# Altium schematic sheet [02] - BLOCK DIAGRAM.SchDoc
size A2; DocumentNumber: 2; SheetNumber: 2; SheetTotal: 6; PageSetup: Record=PageOptions|CenterHorizontal=True|CenterVertical=True|PrintScale=0.52|XCorrection=1.00|YCorrection=1.00|PrintKind=1|BorderSize=5000000|LeftOffset=0|BottomOffset=0|Orientation=2|PaperLength=1000|PaperWidth=1000|Scale=100|PaperSource=4|PrintQuality=600|MediaType=1|DitherType=10|PrintScaleMode=1|PaperKind=A4|PaperIndex=9
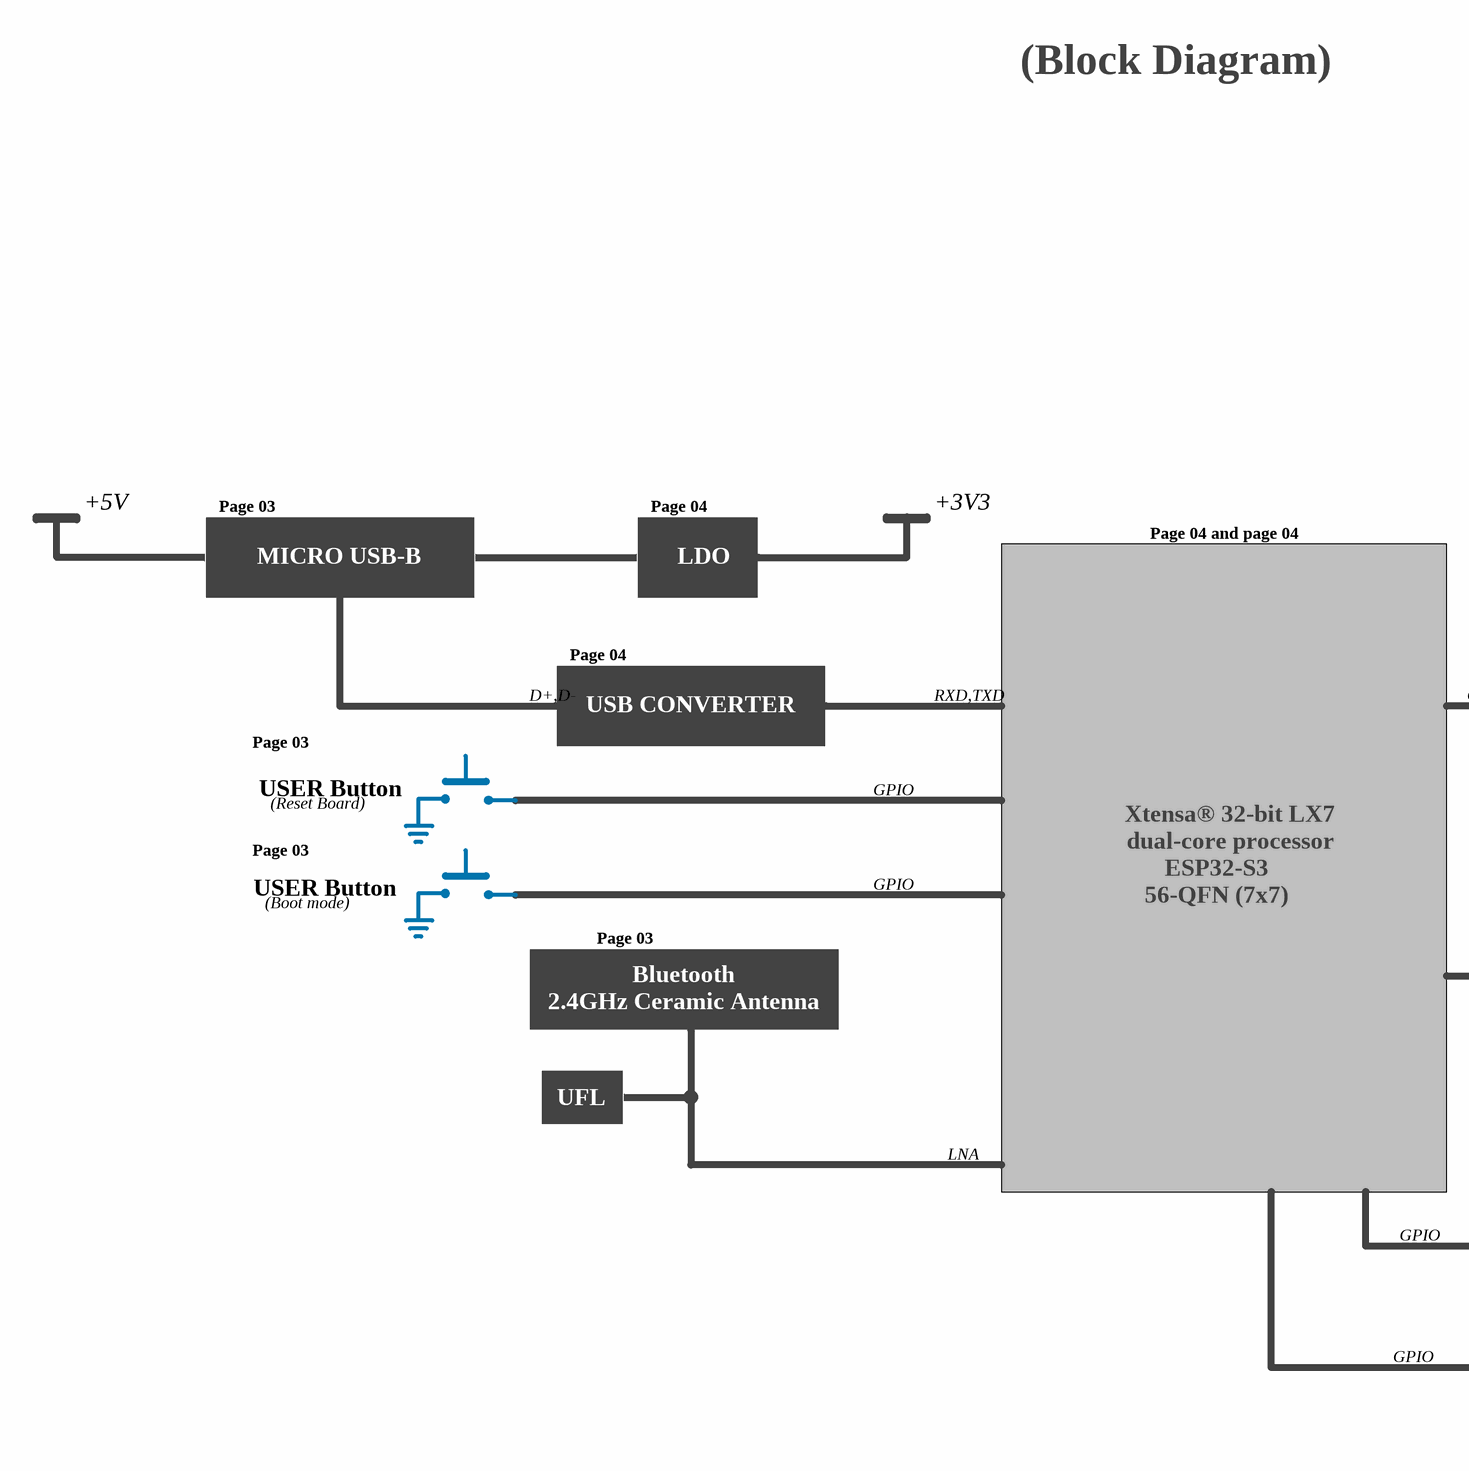
[diagram p0: [02] - BLOCK DIAGRAM.SchDoc, left]
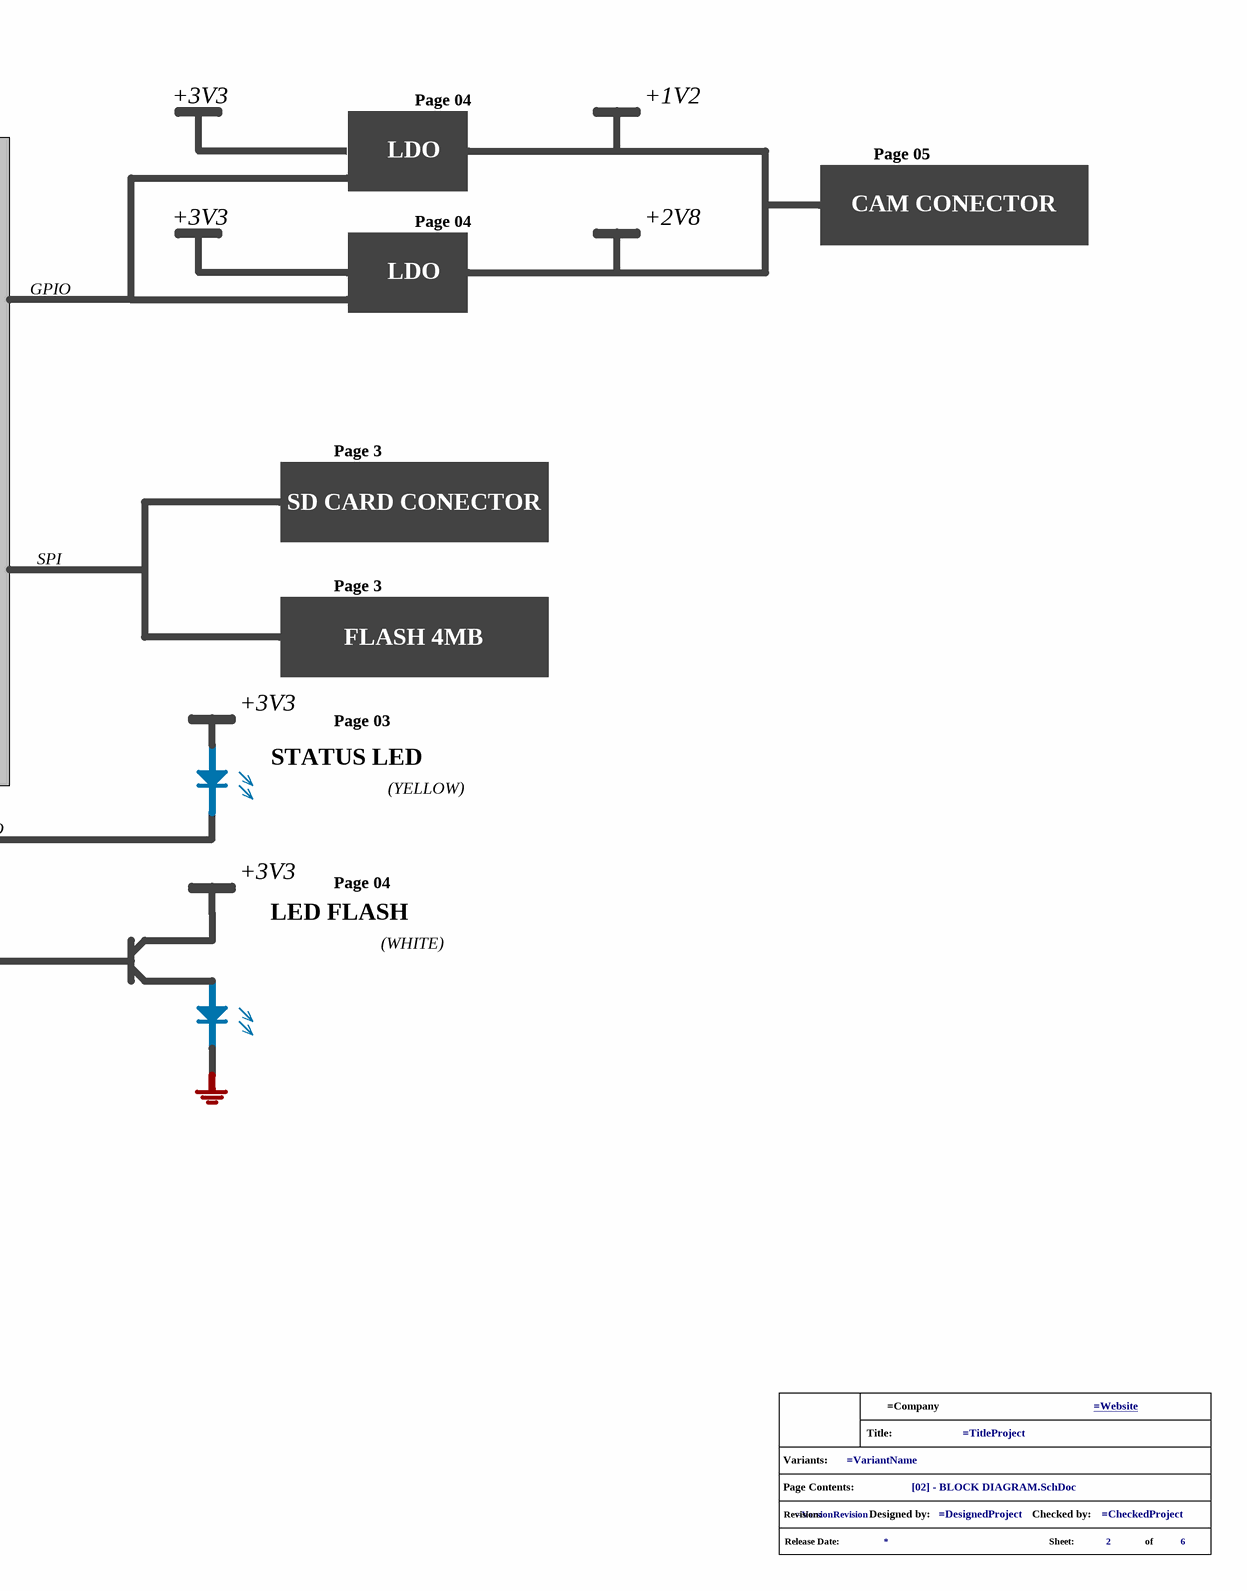
[diagram p1: [02] - BLOCK DIAGRAM.SchDoc, right]

## Parts
GPH?  info_project  (value not drawn)  (graphical)

## Notes on the sheet
- (Block Diagram)
- +5V
- Page 03
- Page 04
- +3V3
- Page 04 and page 04
- +1V2
- MICRO USB-B
- LDO
- Page 05
- +2V8
- CAM CONECTOR
- D+,D-
- USB CONVERTER
- RXD,TXD
- GPIO
- (Reset Board)
- USER Button
- Xtensa® 32-bit LX7
- ESP32-S3
- dual-core processor
- Page 3
- (Boot mode)
- 56-QFN (7x7)
- SD CARD CONECTOR
- 2.4GHz Ceramic Antenna
- Bluetooth
- SPI
- FLASH 4MB
- UFL
- LNA
- STATUS LED
- (YELLOW)
- LED FLASH
- (WHITE)
- (in symbol info_project) Title:; Variants:; Page Contents:; Revision:; Designed by:; Checked by:; Release Date:; Sheet:; of

## Library data of the parts
GPH? = info_project: GRAPHICAL - Info Project